# Altium schematic sheet Clocking.SchDoc
size 431 x 279 mm; Organization: ORGANIZATION; Address1: ADDRESS 1; Address2: ADDRESS 2; Address3: ADDRESS 3; Address4: ADDRESS 4; Revision: -; SheetNumber: 5; SheetTotal: 8; ENG_APP_DATE: --/--/--; DSN_APP_DATE: --/--/--; CHK_APP_DATE: --/--/--
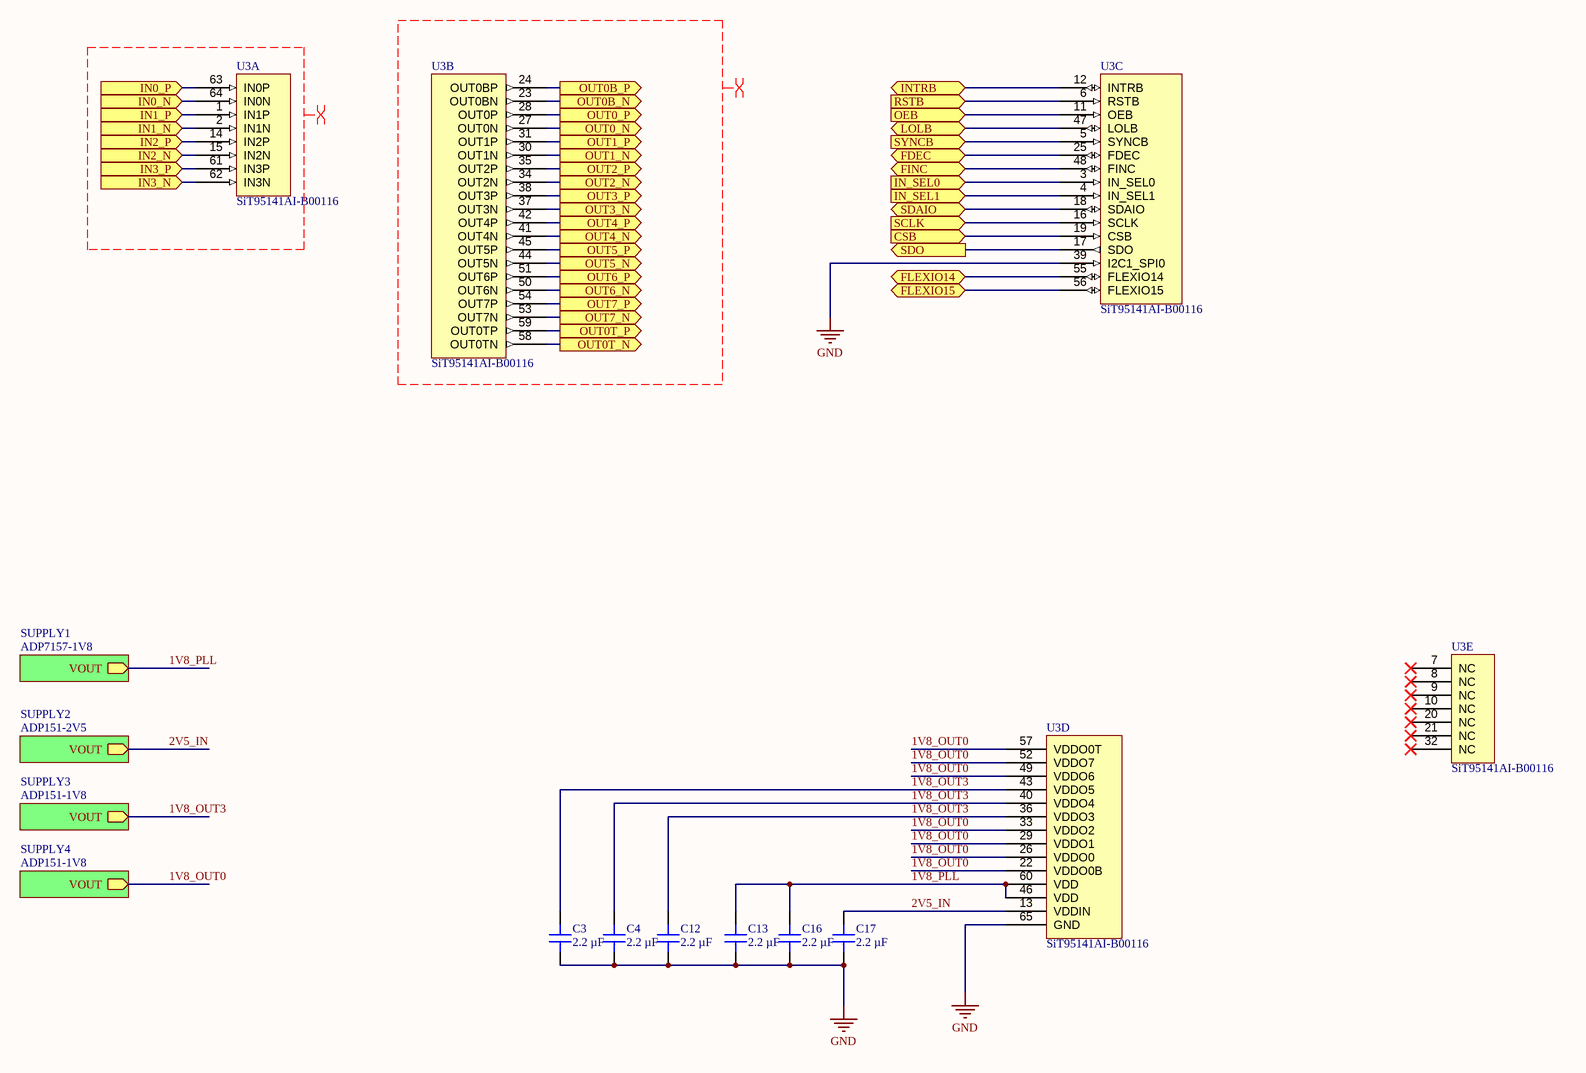
[diagram p0: Clocking.SchDoc]

## Parts
C3  2.2 µF  [CAP 0201_0603]
C4  2.2 µF  [CAP 0201_0603]
C12  2.2 µF  [CAP 0201_0603]
C13  2.2 µF  [CAP 0201_0603]
C16  2.2 µF  [CAP 0201_0603]
C17  2.2 µF  [CAP 0201_0603]
U3  SiT95141AI-B00116  [QFN50P900X900X90_HS-65N]  (parts A,B,C,D,E of 5)

## Sub-sheets
SUPPLY1 = ADP7157-1V8: VOUT (out)
SUPPLY2 = ADP151-2V5: VOUT (out)
SUPPLY3 = ADP151-1V8: VOUT (out)
SUPPLY4 = ADP151-1V8: VOUT (out)

## Ports
CSB (in), FDEC (bidir), FINC (bidir), FLEXIO14 (bidir), FLEXIO15 (bidir), IN0_N (in), IN0_P (in), IN1_N (in), IN1_P (in), IN2_N (in), IN2_P (in), IN3_N (in), IN3_P (in), IN_SEL0 (in), IN_SEL1 (in), INTRB (bidir), LOLB (bidir), OEB (in), OUT0_N (out), OUT0_P (out), OUT0B_N (out), OUT0B_P (out), OUT0T_N (out), OUT0T_P (out), OUT1_N (out), OUT1_P (out), OUT2_N (out), OUT2_P (out), OUT3_N (out), OUT3_P (out), OUT4_N (out), OUT4_P (out), OUT5_N (out), OUT5_P (out), OUT6_N (out), OUT6_P (out), OUT7_N (out), OUT7_P (out), RSTB (in), SCLK (in), SDAIO (bidir), SDO (out), SYNCB (in)

## Nets
GND: C3.1 C4.1 C12.1 C13.1 C16.1 C17.1 U3.39(I2C1_SPI0) U3.65(GND)
1V8_OUT0: U3.22(VDDO0B) U3.26(VDDO0) U3.29(VDDO1) U3.33(VDDO2) U3.49(VDDO6) U3.52(VDDO7) U3.57(VDDO0T) ; sheet SUPPLY4/VOUT
1V8_OUT3: C3.2 C4.2 C12.2 U3.36(VDDO3) U3.40(VDDO4) U3.43(VDDO5) ; sheet SUPPLY3/VOUT
1V8_PLL: C13.2 C16.2 U3.46(VDD) U3.60(VDD) ; sheet SUPPLY1/VOUT
2V5_IN: C17.2 U3.13(VDDIN) ; sheet SUPPLY2/VOUT
CSB: U3.19(CSB) ; port CSB
FDEC: U3.25(FDEC) ; port FDEC
FINC: U3.48(FINC) ; port FINC
FLEXIO14: U3.55(FLEXIO14) ; port FLEXIO14
FLEXIO15: U3.56(FLEXIO15) ; port FLEXIO15
IN0_N: U3.64(IN0N) ; port IN0_N
IN0_P: U3.63(IN0P) ; port IN0_P
IN1_N: U3.2(IN1N) ; port IN1_N
IN1_P: U3.1(IN1P) ; port IN1_P
IN2_N: U3.15(IN2N) ; port IN2_N
IN2_P: U3.14(IN2P) ; port IN2_P
IN3_N: U3.62(IN3N) ; port IN3_N
IN3_P: U3.61(IN3P) ; port IN3_P
IN_SEL0: U3.3(IN_SEL0) ; port IN_SEL0
IN_SEL1: U3.4(IN_SEL1) ; port IN_SEL1
INTRB: U3.12(INTRB) ; port INTRB
LOLB: U3.47(LOLB) ; port LOLB
OEB: U3.11(OEB) ; port OEB
OUT0_N: U3.27(OUT0N) ; port OUT0_N
OUT0_P: U3.28(OUT0P) ; port OUT0_P
OUT0B_N: U3.23(OUT0BN) ; port OUT0B_N
OUT0B_P: U3.24(OUT0BP) ; port OUT0B_P
OUT0T_N: U3.58(OUT0TN) ; port OUT0T_N
OUT0T_P: U3.59(OUT0TP) ; port OUT0T_P
OUT1_N: U3.30(OUT1N) ; port OUT1_N
OUT1_P: U3.31(OUT1P) ; port OUT1_P
OUT2_N: U3.34(OUT2N) ; port OUT2_N
OUT2_P: U3.35(OUT2P) ; port OUT2_P
OUT3_N: U3.37(OUT3N) ; port OUT3_N
OUT3_P: U3.38(OUT3P) ; port OUT3_P
OUT4_N: U3.41(OUT4N) ; port OUT4_N
OUT4_P: U3.42(OUT4P) ; port OUT4_P
OUT5_N: U3.44(OUT5N) ; port OUT5_N
OUT5_P: U3.45(OUT5P) ; port OUT5_P
OUT6_N: U3.50(OUT6N) ; port OUT6_N
OUT6_P: U3.51(OUT6P) ; port OUT6_P
OUT7_N: U3.53(OUT7N) ; port OUT7_N
OUT7_P: U3.54(OUT7P) ; port OUT7_P
RSTB: U3.6(RSTB) ; port RSTB
SCLK: U3.16(SCLK) ; port SCLK
SDAIO: U3.18(SDAIO) ; port SDAIO
SDO: U3.17(SDO) ; port SDO
SYNCB: U3.5(SYNCB) ; port SYNCB

Not connected (* = marked no-connect by the designer): U3 7(NC)* 8(NC)* 9(NC)* 10(NC)* 20(NC)* 21(NC)* 32(NC)*

## Layout directives
differential pair; net class REFCLK; differential pair class REFCLK: (no net found under the mark)

## Notes on the sheet
- DWG. NO.
- REV.
- SHT.
- REVISION
- DESCRIPTION
- DATE
- APPROVED
- ENG:
- APPROVALS
- PROJECT
- DSN:
- CHK:
- REFERENCE DOCUMENTS
- PROJECT REVISION:
- TITLE
- SimulaVR
- DOCUMENT REVISION:
- DESIGN ITEM:
- BOM:
- FAB DWG:
- PCB DWG:
- ASSY DWG:
- SCALE:
- SIZE
- B
- CAGE CODE
- FILE NAME
- DWG NO.
- SHEET
- OF
- REV

## Library data of the parts
C3 C4 C12 C13 C16 C17 = GRM033R60J225ME15D: CAP CER 2.2UF 6.3V X5R 0201; manufacturer: Murata Electronics; Tolerance: ±20%; Part Number: GRM033R60J225ME15D; Value: 2.2 µF; Applications: General Purpose; Capacitance: 2.2 µF; componentlink1description: Datasheet; componentlink1url: https://www.murata.com/~/media/webrenewal/support/library/catalog/products/capacitor/mlcc/c02e.ashx?la=en-us; componentlink2description: DigiKey Link; componentlink2url: https://www.digikey.com/en/products/detail/murata-electronics/GRM033R60J225ME15D/5877387; Device Package: 0201 (0603 Metric); lastupdated: 8/14/2022 9:02:48 PM; Lifecycle Status: Active; Minimum Order: 1; Mounting Type: Surface Mount, MLCC; Operating Temperature: -55°C ~ 85°C; Package / Case: 0201 (0603 Metric); packaging: TapeAndReel; Part Status: Active; price: 0.04; series: GRM; Size / Dimension: 0.024" L x 0.012" W (0.60mm x 0.30mm); Supplier 1: DigiKey; Supplier Part Number 1: 490-13224-1-ND; Temperature Coefficient: X5R; Thickness (Max): 0.014" (0.35mm); Voltage - Rated: 6.3V; partid: 411
U3 = CMP-023-00000-1